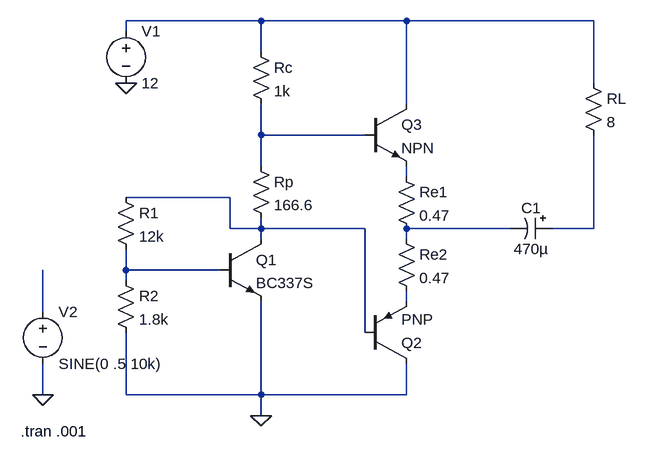
[diagram p0: schematic Parcial.asc]
Parcial.asc, the LTspice schematic file:
Version 4
SHEET 1 880 680
WIRE 272 -128 64 -128
WIRE 496 -128 272 -128
WIRE 784 -128 496 -128
WIRE 64 -112 64 -128
WIRE 272 -80 272 -128
WIRE 784 -32 784 -128
WIRE 496 0 496 -128
WIRE 272 48 272 0
WIRE 432 48 272 48
WIRE 272 96 272 48
WIRE 496 112 496 96
WIRE 224 144 64 144
WIRE 224 192 224 144
WIRE 272 192 272 176
WIRE 272 192 224 192
WIRE 432 192 272 192
WIRE 656 192 496 192
WIRE 784 192 784 48
WIRE 784 192 720 192
WIRE 272 208 272 192
WIRE 496 208 496 192
WIRE 64 256 64 224
WIRE 208 256 64 256
WIRE 64 272 64 256
WIRE 496 304 496 288
WIRE -64 320 -64 256
WIRE 432 352 432 192
WIRE -64 448 -64 400
WIRE 64 448 64 352
WIRE 272 448 272 304
WIRE 272 448 64 448
WIRE 496 448 496 400
WIRE 496 448 272 448
WIRE 272 480 272 448
FLAG 64 -32 0
FLAG 272 480 0
FLAG -64 448 0
SYMBOL res 48 128 R0
SYMATTR InstName R1
SYMATTR Value 12k
SYMBOL res 48 256 R0
SYMATTR InstName R2
SYMATTR Value 1.8k
SYMBOL npn 208 208 R0
SYMATTR InstName Q1
SYMATTR Value BC337S
SYMBOL res 480 96 R0
SYMATTR InstName Re1
SYMATTR Value 0.47
SYMBOL res 480 192 R0
SYMATTR InstName Re2
SYMATTR Value 0.47
SYMBOL res 256 -96 R0
SYMATTR InstName Rc
SYMATTR Value 1k
SYMBOL res 256 80 R0
SYMATTR InstName Rp
SYMATTR Value 166.6
SYMBOL voltage 64 -128 R0
SYMATTR InstName V1
SYMATTR Value 12
SYMBOL voltage -64 304 R0
WINDOW 123 0 0 Left 0
WINDOW 39 0 0 Left 0
SYMATTR InstName V2
SYMATTR Value SINE(0 .5 10k)
SYMBOL res 768 -48 R0
SYMATTR InstName RL
SYMATTR Value 8
SYMBOL polcap 720 176 R90
WINDOW 0 0 32 VBottom 2
WINDOW 3 32 32 VTop 2
SYMATTR InstName C1
SYMATTR Value 470µ
SYMATTR Description Capacitor
SYMATTR Type cap
SYMATTR SpiceLine V=50 Irms=1.49 Rser=0.044 Lser=0 mfg="United Chemi-Con" pn="LXF50VB471M12X25LL" type="Al electrolytic"
SYMBOL pnp 432 400 M180
SYMATTR InstName Q2
SYMBOL npn 432 0 R0
SYMATTR InstName Q3
TEXT -98 504 Left 2 !.tran .001

The netlist it stands for:
* Parcial.asc
R1 N004 N007 12k
R2 N007 0 1.8k
Q1 N004 N007 0 0 BC337S
Re1 N003 N005 0.47
Re2 N005 N008 0.47
Rc N001 N002 1k
Rp N002 N004 166.6
V1 N001 0 12
V2 N009 0 SINE(0 .5 10k)
RL N001 N006 8
C1 N006 N005 470µ V=50 Irms=1.49 Rser=0.044 Lser=0 mfg="United Chemi-Con" pn="LXF50VB471M12X25LL" type="Al electrolytic"
Q2 0 N004 N008 0 PNP
Q3 N001 N002 N003 0 NPN
.model NPN NPN
.model PNP PNP
.lib standard.bjt
.tran .001
.backanno
.end